# EAGLE design KBConvE7 (EAGLE 7.7.0)
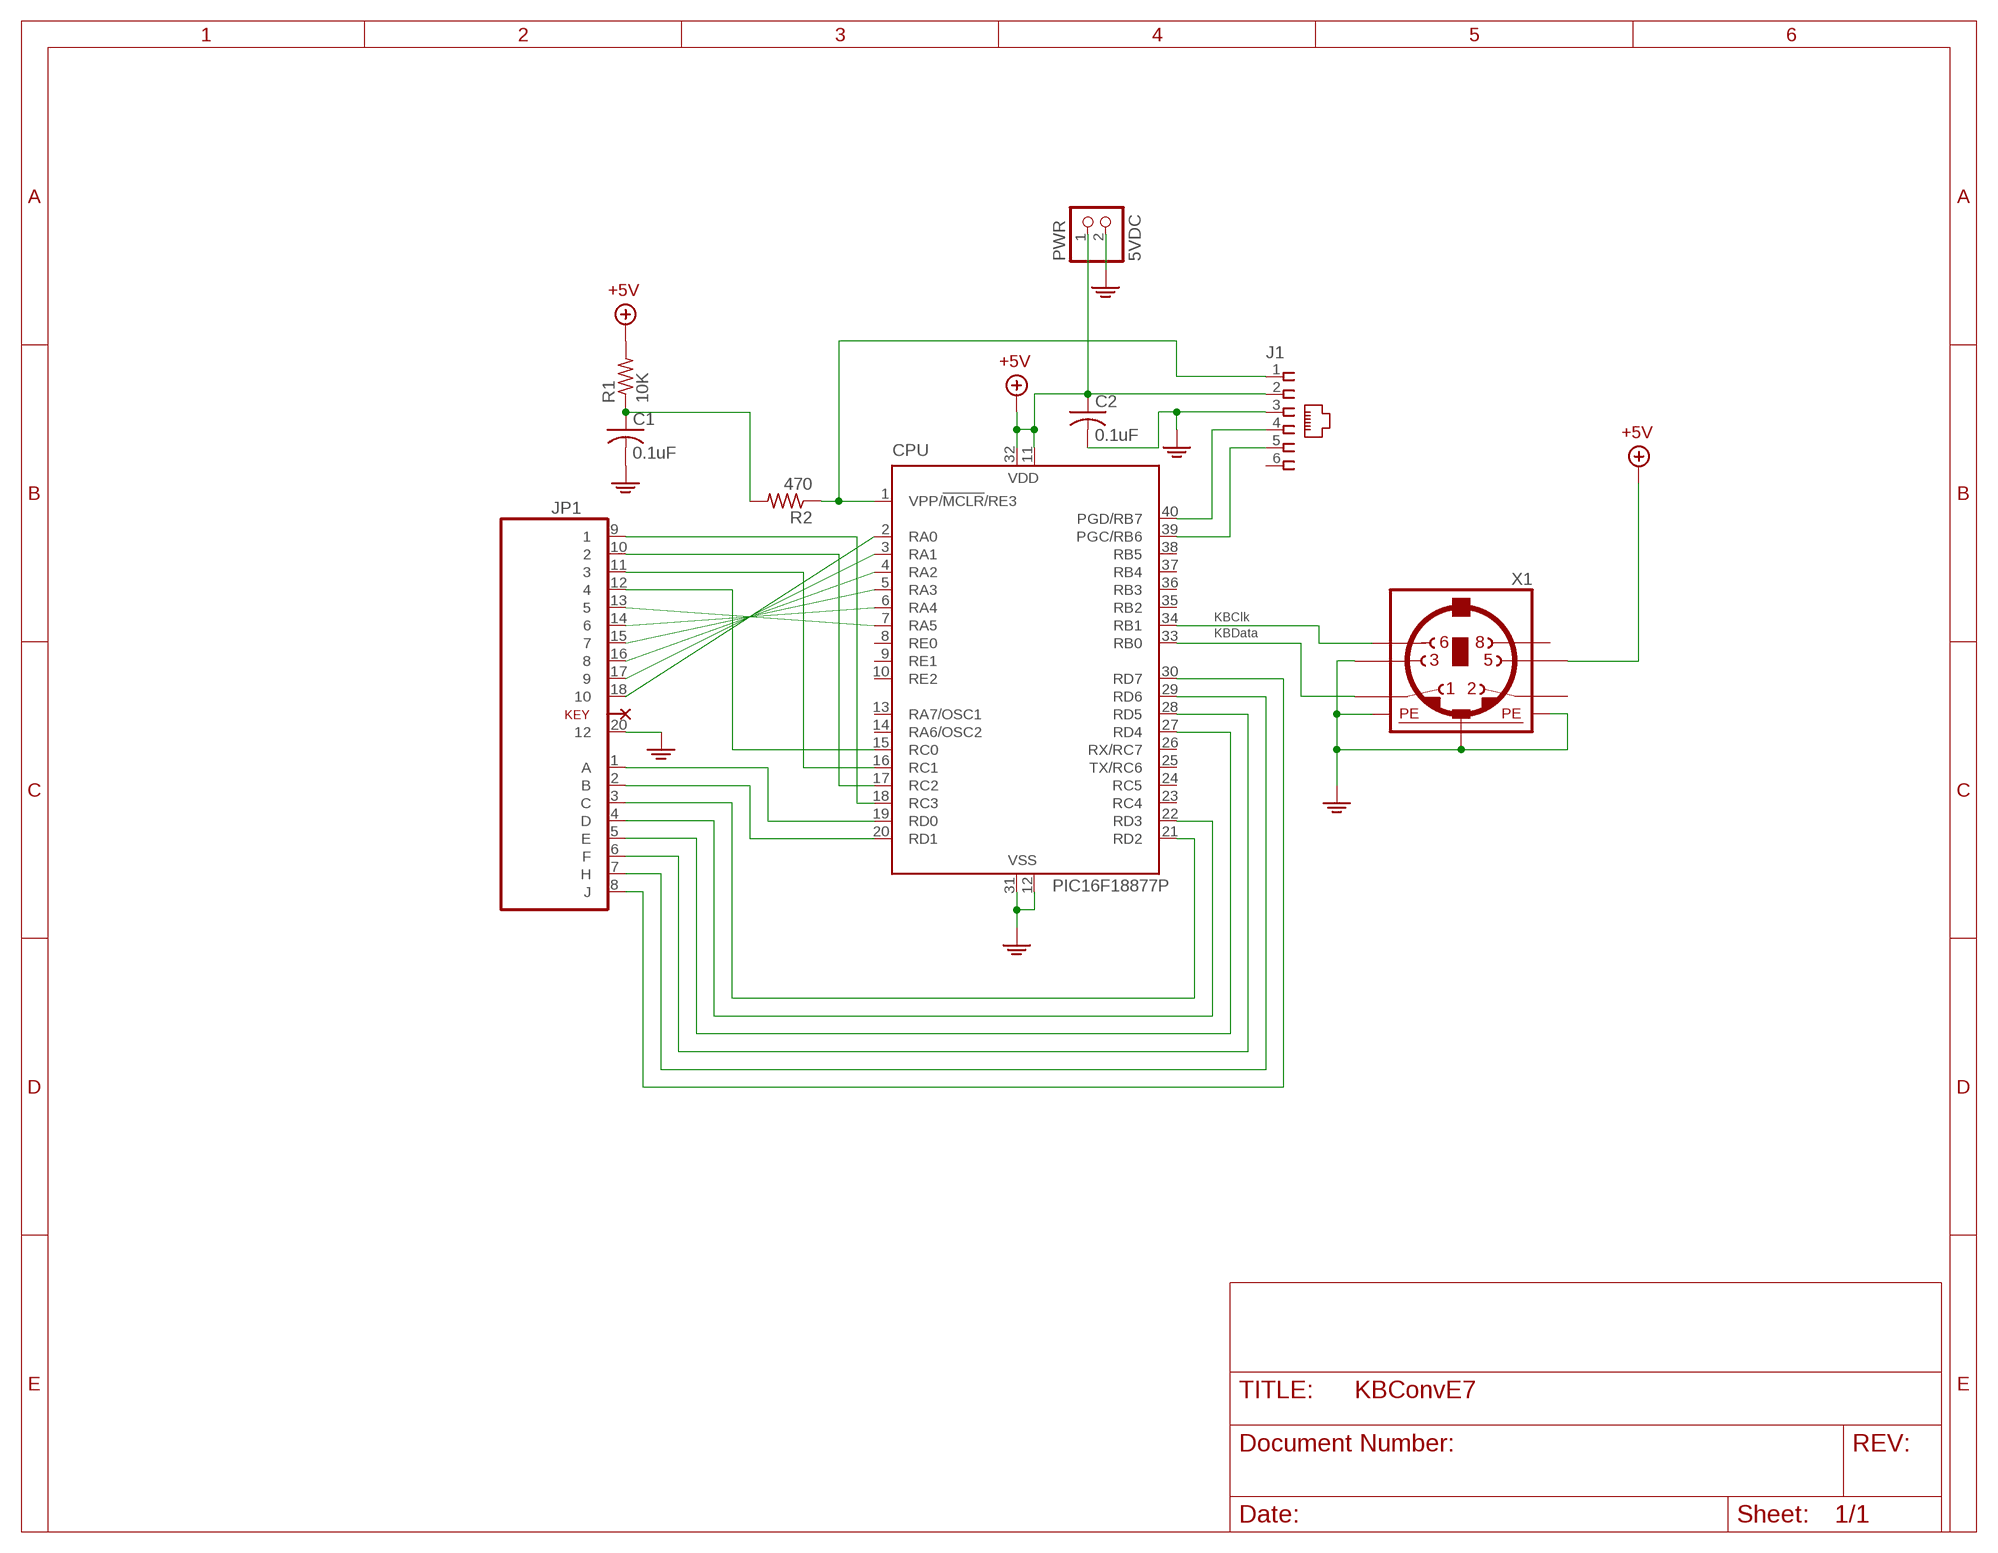
[diagram p0: schematic, sheet 1]

## Parts
C1  0.1uF  C-US025-025X050  [C025-025X050]
C2  0.1uF  C-US025-025X050  [C025-025X050]
CPU  PIC16F18877P  [DIL40]
J1  520250-3  [520250-3]
JP1  PET_KEYBOARD  [PET_KEYBOARD]
PWR  5VDC  PINHD-1X2  [1X02]
R1  10K  R-US_0207/10  [0207/10]
R2  470  R-US_0207/10  [0207/10]
X1  MINI_DIN_6  [M_DIN6]

## Nets
+5V: C2.1 CPU.11(VDD) CPU.32(VDD) J1.2 PWR.1 R1.2 X1.5
GND: C1.2 C2.2 CPU.12(VSS) CPU.31(VSS) J1.3 JP1.20 PWR.2 X1.3 X1.SH1(PE1) X1.SH2(PE2) X1.SH3(PE3)
N$1: CPU.2(RA0) JP1.18
N$2: CPU.3(RA1) JP1.17
N$3: CPU.4(RA2) JP1.16
N$4: CPU.5(RA3) JP1.15
N$5: CPU.6(RA4) JP1.14
N$6: CPU.7(RA5) JP1.13
N$7: CPU.15(RC0) JP1.12
N$8: CPU.16(RC1) JP1.11
N$9: CPU.17(RC2) JP1.10
N$10: CPU.18(RC3) JP1.9
N$11: CPU.19(RD0) JP1.1(A)
N$12: CPU.20(RD1) JP1.2(B)
N$13: CPU.21(RD2) JP1.3(C)
N$14: CPU.22(RD3) JP1.4(D)
N$15: CPU.27(RD4) JP1.5(E)
N$17: CPU.33(RB0) X1.1
N$18: CPU.28(RD5) JP1.6(F)
N$19: CPU.29(RD6) JP1.7(H)
N$20: CPU.30(RD7) JP1.8(J)
N$21: C1.1 R1.1 R2.2
N$22: CPU.39(PGC/RB6) J1.5
N$23: CPU.40(PGD/RB7) J1.4
N$24: CPU.34(RB1) X1.6
N$28: CPU.1(VPP/!MCLR!/RE3) J1.1 R2.1
Unconnected: CPU.8(RE0) CPU.9(RE1) CPU.10(RE2) CPU.13(RA7/OSC1) CPU.14(RA6/OSC2) CPU.23(RC4) CPU.24(RC5) CPU.25(TX/RC6) CPU.26(RX/RC7) CPU.35(RB2) CPU.36(RB3) CPU.37(RB4) CPU.38(RB5) J1.6 X1.2 X1.8

## Notes on the sheet
- KBClk
- KBData

## Library data of the parts
C1 C2 = rcl:C-US: CAPACITOR, American symbol
CPU = microchip-K:PIC16F18877P
J1 = Parts_Test:520250-3: AMP connector
JP1 = 320349C:PET_KEYBOARD: PIN HEADER
PWR = Parts_Test:PINHD-1X2: PIN HEADER
R1 R2 = rcl:R-US_: RESISTOR, American symbol
X1 = mini_din:MINI_DIN_6

## Board
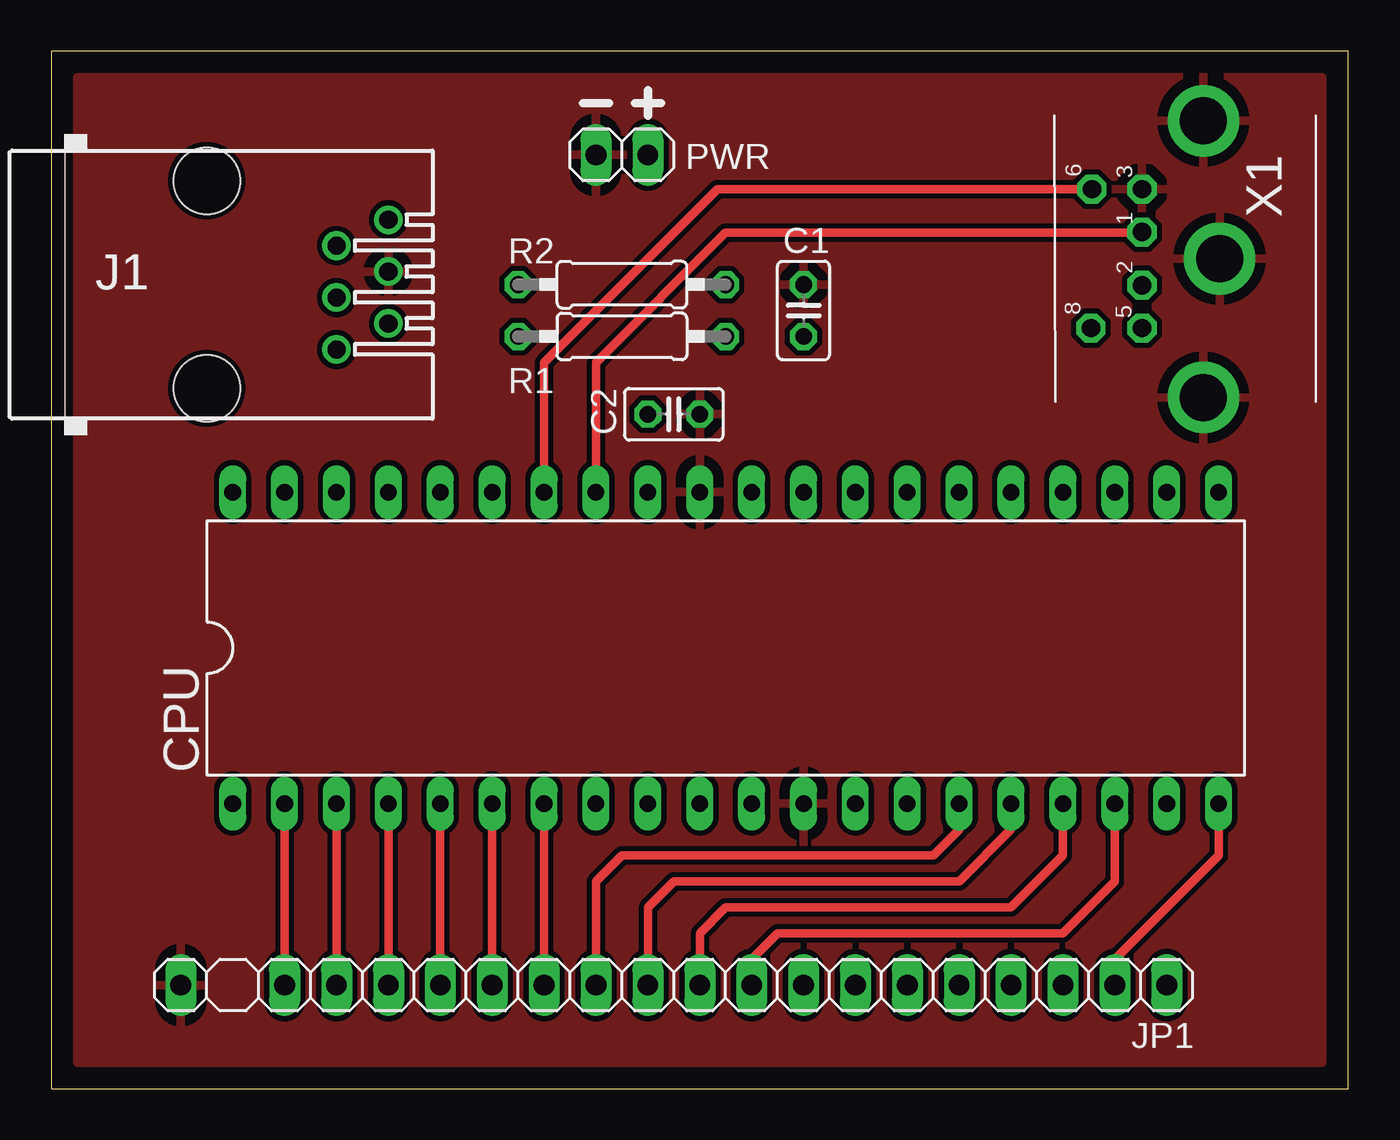
[diagram p1: board, top side]
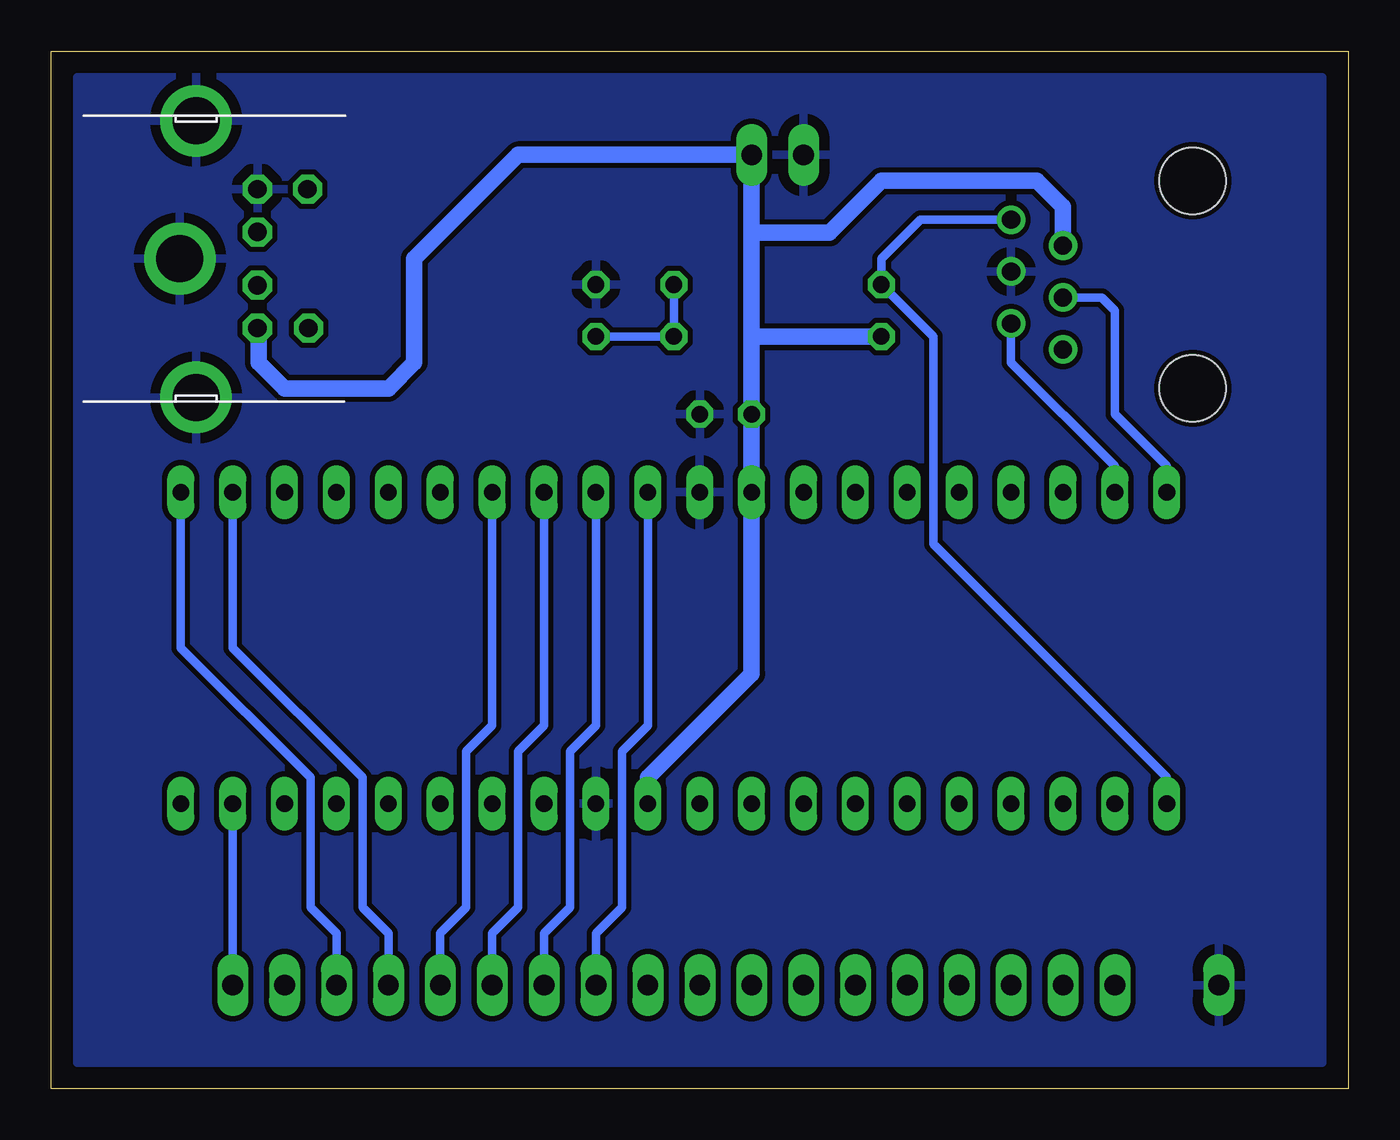
[diagram p2: board, bottom side, seen from below]

Size 63.5 x 50.8 mm. Coordinates in mm from the lower left corner, seen from the top.
Outline: 0,0 63.5,0 63.5,50.8 0,50.8 0,0
Copper layers (1*16): Top 0.035mm / dielectric 1.5mm / Bottom 0.035mm
Design rules "Kens Modified_SeeedStudio_2layer_DRU_no_angle": minimum track width 6mil, minimum drill 12mil, track to track 10mil, track to pad 10mil, pad to pad 10mil, via to via 10mil, smd to smd 0mil, copper to edge 10mil, drill to drill 10mil, minimum pad ring 10mil, minimum via ring 6mil, stop-mask expansion 2mil, vias tented up to drill 100mil, thermal gap 20mil

### Footprints (pad centres in the part's own frame; a part is rotated, then mirrored left to right if it is on the bottom)
C025-025X050 = drill 0.813 octagon: 1 -1.27,0; 2 1.27,0
DIL40 = drill 0.813 long: 1 -24.13,-7.62; 2 -21.59,-7.62; 3 -19.05,-7.62; 4 -16.51,-7.62; 5 -13.97,-7.62; 6 -11.43,-7.62; 7 -8.89,-7.62; 8 -6.35,-7.62; 9 -3.81,-7.62; 10 -1.27,-7.62; 11 1.27,-7.62; 12 3.81,-7.62; 13 6.35,-7.62; 14 8.89,-7.62; 15 11.43,-7.62; 16 13.97,-7.62; 17 16.51,-7.62; 18 19.05,-7.62; 19 21.59,-7.62; 20 24.13,-7.62; 21 24.13,7.62; 22 21.59,7.62; 23 19.05,7.62; 24 16.51,7.62; 25 13.97,7.62; 26 11.43,7.62; 27 8.89,7.62; 28 6.35,7.62; 29 3.81,7.62; 30 1.27,7.62; 31 -1.27,7.62; 32 -3.81,7.62; 33 -6.35,7.62; 34 -8.89,7.62; 35 -11.43,7.62; 36 -13.97,7.62; 37 -16.51,7.62; 38 -19.05,7.62; 39 -21.59,7.62; 40 -24.13,7.62
520250-3 = drill 0.889: 1 -3.175,8.89; 2 -1.905,6.35; 3 -0.635,8.89; 4 0.635,6.35; 5 1.905,8.89; 6 3.175,6.35 | hole 3.251: -5.08,0; 5.08,0
PET_KEYBOARD = drill 1.016 long: 1 -24.13,0; 2 -21.59,0; 3 -19.05,0; 4 -16.51,0; 5 -13.97,0; 6 -11.43,0; 7 -8.89,0; 8 -6.35,0; 9 -3.81,0; 10 -1.27,0; 11 1.27,0; 12 3.81,0; 13 6.35,0; 14 8.89,0; 15 11.43,0; 16 13.97,0; 17 16.51,0; 18 19.05,0; 20 24.13,0
1X02 = drill 1.016 long: 1 -1.27,0; 2 1.27,0
0207/10 = drill 0.813 octagon: 1 -5.08,0; 2 5.08,0
M_DIN6 = drill 0.9 pad 1.422 octagon: 1 -1.3,-3.75; 2 1.3,-3.75; 3 -3.4,-3.75; 5 3.4,-3.75; 6 -3.4,-6.2; 8 3.4,-6.25 | drill 2.3 pad 3.5: SH1 6.8,-0.75; SH2 0,0.05; SH3 -6.75,-0.75

### Placement (x,y rotation side)
C1  36.83,38.1 90 top
C2  30.48,33.02 0 top
CPU  33.02,21.59 0 top
J1  7.62,39.37 270 top
JP1  30.48,5.08 180 top
PWR  27.94,45.72 180 top
R1  27.94,36.83 180 top
R2  27.94,39.37 0 top
X1  57.15,40.64 270 top

### Tracks (layer width: path | path; a pad name or v marks a point on that pad's centre or on a via)
+5V
  Bottom 0.813: CPU.11 34.29,15.24 29.21,20.32 CPU.32 C2.1 29.21,36.83 | X1.5 53.34,37.18 53.34,35.56 52.07,34.29 46.99,34.29 45.72,35.56 45.72,40.64 40.64,45.72 PWR.1 29.21,41.91 | 29.21,36.83 R1.2 | 29.21,36.83 29.21,41.91 | J1.2 13.97,43.18 15.24,44.45 22.86,44.45 25.4,41.91 29.21,41.91
GND
  pour Top: 1.27,49.53 62.23,49.53 62.23,1.27 1.27,1.27
  pour Bottom: 1.27,49.53 62.23,49.53 62.23,1.27 1.27,1.27
N$1
  Top 0.406: JP1.18 CPU.2
N$2
  Top 0.406: JP1.17 CPU.3
N$3
  Top 0.406: JP1.16 CPU.4
N$4
  Top 0.406: JP1.15 CPU.5
N$5
  Top 0.406: JP1.14 CPU.6
N$6
  Top 0.406: JP1.13 CPU.7
N$7
  Top 0.406: CPU.15 44.45,12.7 43.18,11.43 27.94,11.43 26.67,10.16 JP1.12
N$8
  Top 0.406: CPU.16 46.99,12.7 44.45,10.16 30.48,10.16 29.21,8.89 JP1.11
N$9
  Top 0.406: CPU.17 49.53,11.43 46.99,8.89 33.02,8.89 31.75,7.62 JP1.10
N$10
  Top 0.406: CPU.18 52.07,10.16 49.53,7.62 35.56,7.62 34.29,6.35 JP1.9
N$11
  Bottom 0.406: JP1.1 CPU.19
N$12
  Top 0.406: JP1.2 52.07,6.35 57.15,11.43 CPU.20
N$13
  Bottom 0.406: CPU.21 57.15,21.59 50.8,15.24 50.8,8.89 49.53,7.62 JP1.3
N$14
  Bottom 0.406: CPU.22 54.61,21.59 48.26,15.24 48.26,8.89 46.99,7.62 JP1.4
N$15
  Bottom 0.406: CPU.27 41.91,17.78 43.18,16.51 43.18,8.89 44.45,7.62 JP1.5
N$17
  Top 0.406: CPU.33 26.67,35.56 33.02,41.91 53.37,41.91 X1.1
N$18
  Bottom 0.406: CPU.28 39.37,17.78 40.64,16.51 40.64,8.89 41.91,7.62 JP1.6
N$19
  Bottom 0.406: CPU.29 36.83,17.78 38.1,16.51 38.1,8.89 39.37,7.62 JP1.7
N$20
  Bottom 0.406: CPU.30 34.29,17.78 35.56,16.51 35.56,8.89 36.83,7.62 JP1.8
N$21
  Bottom 0.406: R2.2 R1.1 C1.1
N$22
  Bottom 0.406: J1.5 16.51,35.56 11.43,30.48 CPU.39
N$23
  Bottom 0.406: J1.4 12.06,38.73 11.43,38.1 11.43,33.02 8.89,30.48 CPU.40
N$24
  Top 0.406: CPU.34 24.13,35.56 32.61,44.04 X1.6
N$28
  Bottom 0.406: J1.1 20.95,42.55 22.86,40.64 R2.1 20.32,36.83 20.32,26.67 8.89,15.24 CPU.1